# Altium project Placa_Controle_Single_Nano_BLE_Sense.PrjPcb
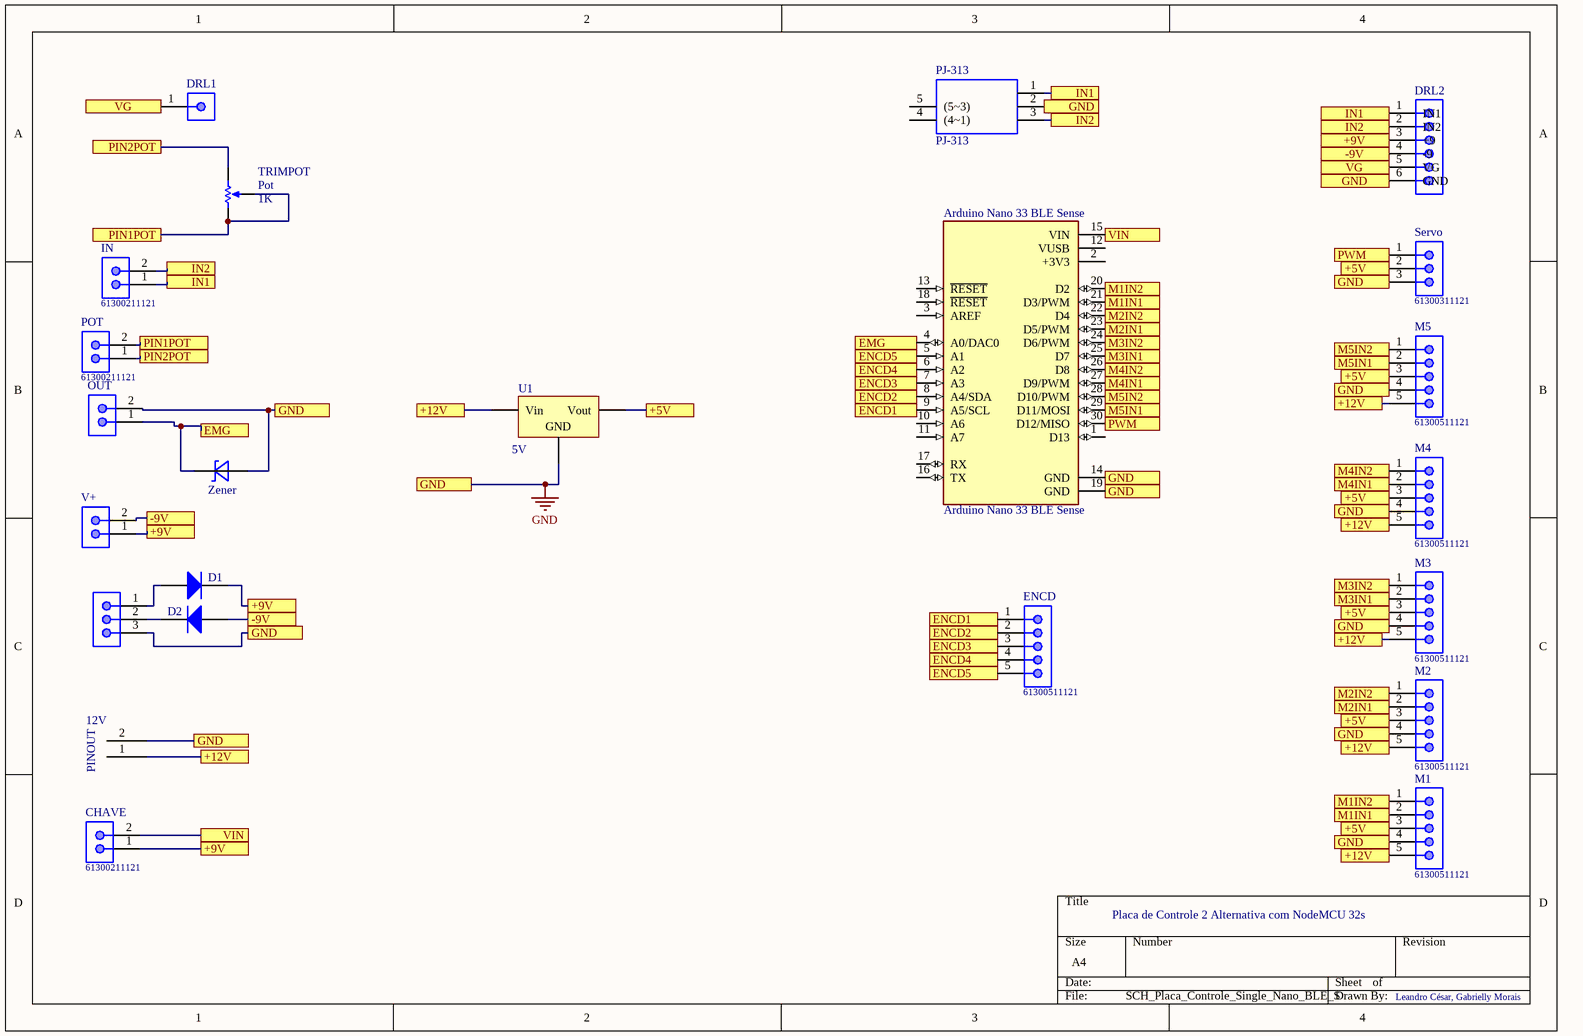
[diagram p0: SCH_Placa_Controle_Single_Nano_BLE_Sense.SchDoc]
1 sheet, 23 parts. Net scope: flat (ports and power ports of the same name join across sheets).
Board file: PCB_Placa_Controle_Single_Nano_BLE_Sense.PcbDoc

## Sheet SCH_Placa_Controle_Single_Nano_BLE_Sense.SchDoc
size A4

### Parts
12V  PINOUT  [Conn header 1x2 TH]  (value not drawn)
+9V  (no value)  [61300311121]
Arduino_Nano_33_BLE_Sense  Arduino Nano 33 BLE Sense  [MODULE_ABX00027]
CHAVE  61300211121  [61300211121]
D1  Diode 1N4148  [DO-35]  (value not drawn)
D2  Diode 1N4148  [DO-35]  (value not drawn)
DRL1  61300111121  [61300111121]  (value not drawn)
DRL2  (no value)  [61300611121]
ENCD  61300511121  [61300511121]
IN  61300211121  [61300211121]
M1  61300511121  [61300511121]
M2  61300511121  [61300511121]
M3  61300511121  [61300511121]
M4  61300511121  [61300511121]
M5  61300511121  [61300511121]
OUT  (no value)  [61300211121]
PJ-313  PJ-313  [PJ313]
POT  61300211121  [61300211121]
Servo  61300311121  [61300311121]
TRIMPOT  Pot  value 1K  [TRIMPOT]
U1  5V  [TO-220-AB]
V+  (no value)  [61300211121]
Zener  1N4728A  [DIOAD1060W80L410D260]  (value not drawn)

### Ports
+5V, +9V, +12V, -9V, EMG, ENCD1, ENCD2, ENCD3, ENCD4, ENCD5, GND, IN1, IN2, M1IN1, M1IN2, M2IN1, M2IN2, M3IN1, M3IN2, M4IN1, M4IN2, M5IN1, M5IN2, PIN1POT, PIN2POT, PWM, VG, VIN

### Nets
GND: 12V.2(V+) +9V.3 Arduino_Nano_33_BLE_Sense.14(GND) Arduino_Nano_33_BLE_Sense.19(GND) DRL2.6(GND) M1.4 M2.4 M3.4 M4.4 M5.4 OUT.2 PJ-313.2 Servo.3 U1.2(GND) Zener.A ; port GND
Net12V_1: 12V.1(V+) M1.5 M2.5 M3.5 M4.5 M5.5 U1.1(Vin) ; port +12V
Net+9V_1: +9V.1 D1.1(A)
Net+9V_2: +9V.2 D2.2(K)
NetArduino_Nano_33_BLE_Sense_4: Arduino_Nano_33_BLE_Sense.4(A0/DAC0) OUT.1 Zener.C ; port EMG
NetArduino_Nano_33_BLE_Sense_5: Arduino_Nano_33_BLE_Sense.5(A1) ENCD.5 ; port ENCD5
NetArduino_Nano_33_BLE_Sense_6: Arduino_Nano_33_BLE_Sense.6(A2) ENCD.4 ; port ENCD4
NetArduino_Nano_33_BLE_Sense_7: Arduino_Nano_33_BLE_Sense.7(A3) ENCD.3 ; port ENCD3
NetArduino_Nano_33_BLE_Sense_8: Arduino_Nano_33_BLE_Sense.8(A4/SDA) ENCD.2 ; port ENCD2
NetArduino_Nano_33_BLE_Sense_9: Arduino_Nano_33_BLE_Sense.9(A5/SCL) ENCD.1 ; port ENCD1
NetArduino_Nano_33_BLE_Sense_15: Arduino_Nano_33_BLE_Sense.15(VIN) CHAVE.2 ; port VIN
NetArduino_Nano_33_BLE_Sense_20: Arduino_Nano_33_BLE_Sense.20(D2) M1.1 ; port M1IN2
NetArduino_Nano_33_BLE_Sense_21: Arduino_Nano_33_BLE_Sense.21(D3/PWM) M1.2 ; port M1IN1
NetArduino_Nano_33_BLE_Sense_22: Arduino_Nano_33_BLE_Sense.22(D4) M2.1 ; port M2IN2
NetArduino_Nano_33_BLE_Sense_23: Arduino_Nano_33_BLE_Sense.23(D5/PWM) M2.2 ; port M2IN1
NetArduino_Nano_33_BLE_Sense_24: Arduino_Nano_33_BLE_Sense.24(D6/PWM) M3.1 ; port M3IN2
NetArduino_Nano_33_BLE_Sense_25: Arduino_Nano_33_BLE_Sense.25(D7) M3.2 ; port M3IN1
NetArduino_Nano_33_BLE_Sense_26: Arduino_Nano_33_BLE_Sense.26(D8) M4.1 ; port M4IN2
NetArduino_Nano_33_BLE_Sense_27: Arduino_Nano_33_BLE_Sense.27(D9/PWM) M4.2 ; port M4IN1
NetArduino_Nano_33_BLE_Sense_28: Arduino_Nano_33_BLE_Sense.28(D10/PWM) M5.1 ; port M5IN2
NetArduino_Nano_33_BLE_Sense_29: Arduino_Nano_33_BLE_Sense.29(D11/MOSI) M5.2 ; port M5IN1
NetArduino_Nano_33_BLE_Sense_30: Arduino_Nano_33_BLE_Sense.30(D12/MISO) Servo.1 ; port PWM
NetCHAVE_1: CHAVE.1 D1.2(K) DRL2.3(+9) V+.1 ; port +9V
NetD2_1: D2.1(A) DRL2.4(-9) V+.2 ; port -9V
NetDRL1_1: DRL1.1 DRL2.5(VG) ; port VG
NetDRL2_1: DRL2.1(IN1) IN.1 PJ-313.1 ; port IN1
NetDRL2_2: DRL2.2(IN2) IN.2 PJ-313.3 ; port IN2
NetM1_3: M1.3 M2.3 M3.3 M4.3 M5.3 Servo.2 U1.3(Vout) ; port +5V
NetPOT_1: POT.1 TRIMPOT.1(BOT) ; port PIN2POT
NetPOT_2: POT.2 TRIMPOT.2(TAP) TRIMPOT.3(TOP) ; port PIN1POT

Not connected (* = marked no-connect by the designer): Arduino_Nano_33_BLE_Sense 1(D13) 2(+3V3) 3(AREF) 10(A6) 11(A7) 12(VUSB) 13(~{RESET}) 16(TX) 17(RX) 18(~{RESET}); PJ-313 4((4~1)) 5((5~3))

### Notes on the sheet
- Placa de Controle 2 Alternativa com NodeMCU 32s
- Leandro César, Gabrielly Morais

### Library data of the parts
+9V Servo = 61300311121: WR-PHD Pin Header, THT, pitch 2.54mm, Single Row, Vertical, 3pin; Pin Number: 3; Gender: Male; Rated Current: 3A; Working Voltage: 250VAC; Withstanding Voltage: 500VAC; Contact Resistance: 20mOhm; ComponentLink1Description: Manufacturer; ComponentLink1URL: http://www.we-online.de; ComponentLink2Description: Datasheet; ComponentLink2URL: https://katalog.we-online.de/em/datasheet/6130xx11121.pdf; Part Number: 61300311121; Published Date: June 2019; Publisher: Wurth Elektronik; Pitch: 2.54mm; Operating Temperature: -40 to +105degC; Mounting Technology: THT; Packaging: Bag; Row Number: Single; Orientation: Vertical
Arduino_Nano_33_BLE_Sense = Arduino Nano 33 BLE Sense: ATSAMD21G18A Arduino Nano 33 IoT SAM D ARMÂ® CortexÂ®-M0 + MCU Ù‡ÛŒØ¦Øª Ù…Ø¯ÛŒØ±Ù‡ Ø§Ø±Ø²ÛŒØ§Ø¨ÛŒ Ø¬Ø§Ø³Ø§Ø²ÛŒ Ø´Ø¯Ù‡ 32 Ø¨ÛŒØªÛŒ; MP: ABX00027; Package: None; Availability: Unavailable; SnapEDA_Link: https://www.snapeda.com/parts/ABX00027/Arduino/view-part/3949339/?ref=snap; DigiKey-Purchase-URL: https://snapeda.com/shop?store=DigiKey&id=3949339; Value: *; MF: Arduino; Price: None; Mouser-Purchase-URL: https://snapeda.com/shop?store=Mouser&id=3949339
CHAVE IN OUT POT V+ = 61300211121: WR-PHD Pin Header, THT, pitch 2.54mm, Single Row, Vertical, 2pin; Pin Number: 2; Gender: Male; Rated Current: 3A; Working Voltage: 250VAC; Withstanding Voltage: 500VAC; Contact Resistance: 20mOhm; ComponentLink1Description: Manufacturer; ComponentLink1URL: http://www.we-online.de; ComponentLink2Description: Datasheet; ComponentLink2URL: https://katalog.we-online.de/em/datasheet/6130xx11121.pdf; Part Number: 61300211121; Published Date: June 2019; Publisher: Wurth Elektronik; Pitch: 2.54mm; Operating Temperature: -40 to +105degC; Mounting Technology: THT; Packaging: Bag; Row Number: Single; Orientation: Vertical
D1 D2 = Diode 1N4148: High Conductance Fast Diode; Published: 8-Jun-2000; LatestRevisionDate: 17-Jul-2002; LatestRevisionNote: Re-released for DXP Platform.; DatasheetVersion: 1997; PackageReference: DO-35; Publisher: Altium Limited; PackageDescription: Diode, Axial; Body 3.8 x 1.9 mm (LxDia. max), Lead Dia. 0.53 mm (max); Code_JEDEC: DO-204-AH; ComponentLink1Description: Manufacturer Link; ComponentLink1URL: http://www.fairchildsemi.com/; ComponentLink2Description: Datasheet; ComponentLink2URL: http://www.fairchildsemi.com/ds/1N%2F1N4148.pdf
DRL1 = 61300111121: WR-PHD Pin Header, THT, pitch 2.54mm, Single Row, Vertical, 1pin; Pin Number: 1; Gender: Male; Rated Current: 3A; Working Voltage: 250VAC; Withstanding Voltage: 500VAC; Contact Resistance: 20mOhm; ComponentLink1Description: Manufacturer; ComponentLink1URL: http://www.we-online.de; ComponentLink2Description: Datasheet; ComponentLink2URL: https://katalog.we-online.de/em/datasheet/6130xx11121.pdf; Part Number: 61300111121; Published Date: June 2019; Publisher: Wurth Elektronik; Pitch: 2.54mm; Operating Temperature: -40 to +105degC; Mounting Technology: THT; Packaging: Bag; Row Number: Single; Orientation: Vertical
DRL2 = 61300611121: WR-PHD Pin Header, THT, pitch 2.54mm, Single Row, Vertical, 6pin; Pin Number: 6; Gender: Male; Rated Current: 3A; Working Voltage: 250VAC; Withstanding Voltage: 500VAC; Contact Resistance: 20mOhm; ComponentLink1Description: Manufacturer; ComponentLink1URL: http://www.we-online.de; ComponentLink2Description: Datasheet; ComponentLink2URL: https://katalog.we-online.de/em/datasheet/6130xx11121.pdf; Part Number: 61300611121; Published Date: June 2019; Publisher: Wurth Elektronik; Pitch: 2.54mm; Operating Temperature: -40 to +105degC; Mounting Technology: THT; Packaging: Bag; Row Number: Single; Orientation: Vertical
ENCD M1-M5 = 61300511121: WR-PHD Pin Header, THT, pitch 2.54mm, Single Row, Vertical, 5pin; Pin Number: 5; Gender: Male; Rated Current: 3A; Working Voltage: 250VAC; Withstanding Voltage: 500VAC; Contact Resistance: 20mOhm; ComponentLink1Description: Manufacturer; ComponentLink1URL: http://www.we-online.de; ComponentLink2Description: Datasheet; ComponentLink2URL: https://katalog.we-online.de/em/datasheet/6130xx11121.pdf; Part Number: 61300511121; Published Date: June 2019; Publisher: Wurth Elektronik; Pitch: 2.54mm; Operating Temperature: -40 to +105degC; Mounting Technology: THT; Packaging: Bag; Row Number: Single; Orientation: Vertical
PJ-313 = PJ-313: Phone Jack; Manufacturer_Name: Haoyu; Geometry.Height: 5mm; Manufacturer_Part_Number: PJ-313; RS Part Number: *; RS Price/Stock: *; Arrow Part Number: PJ-313; Arrow Price/Stock: *; Datasheet Link: http://p.globalsources.com/IMAGES/PDT/SPEC/678/K1007224678.pdf
TRIMPOT = Pot: Potentiometer; Sim Note: Enter the Resistance value and the set point into parameter fields.; Set Position: 0.5; Published: 8-Jun-2000; LatestRevisionDate: 17-Jul-2002; LatestRevisionNote: Re-released for DXP Platform.; PackageReference: VR5; Publisher: Altium Limited; PackageDescription: Variable Resistor, Thru-Hole; 3 Leads
U1 = LM78XX: LM7805; Published: 24-Mar-1999; LatestRevisionDate: 29-May-2009; LatestRevisionNote: IPC-7351 Footprint Added.; PackageReference: D2PAK; Publisher: Altium Limited; PackageDescription: 3-Pin Transistor Outline Package 2.54 mm Pitch, 15.1 mm Lead Span
Zener = 1N4728A: Diodo Zener | 3V3 | 1W; MP: 1N4752A; MF: ON Semiconductor; Availability: Unavailable; Package: DO-41 ON Semiconductor; SnapEDA_Link: https://www.snapeda.com/parts/1N4752A/ON%20Semiconductor/view-part/1474353/?ref=snap; Price: None; Value: *